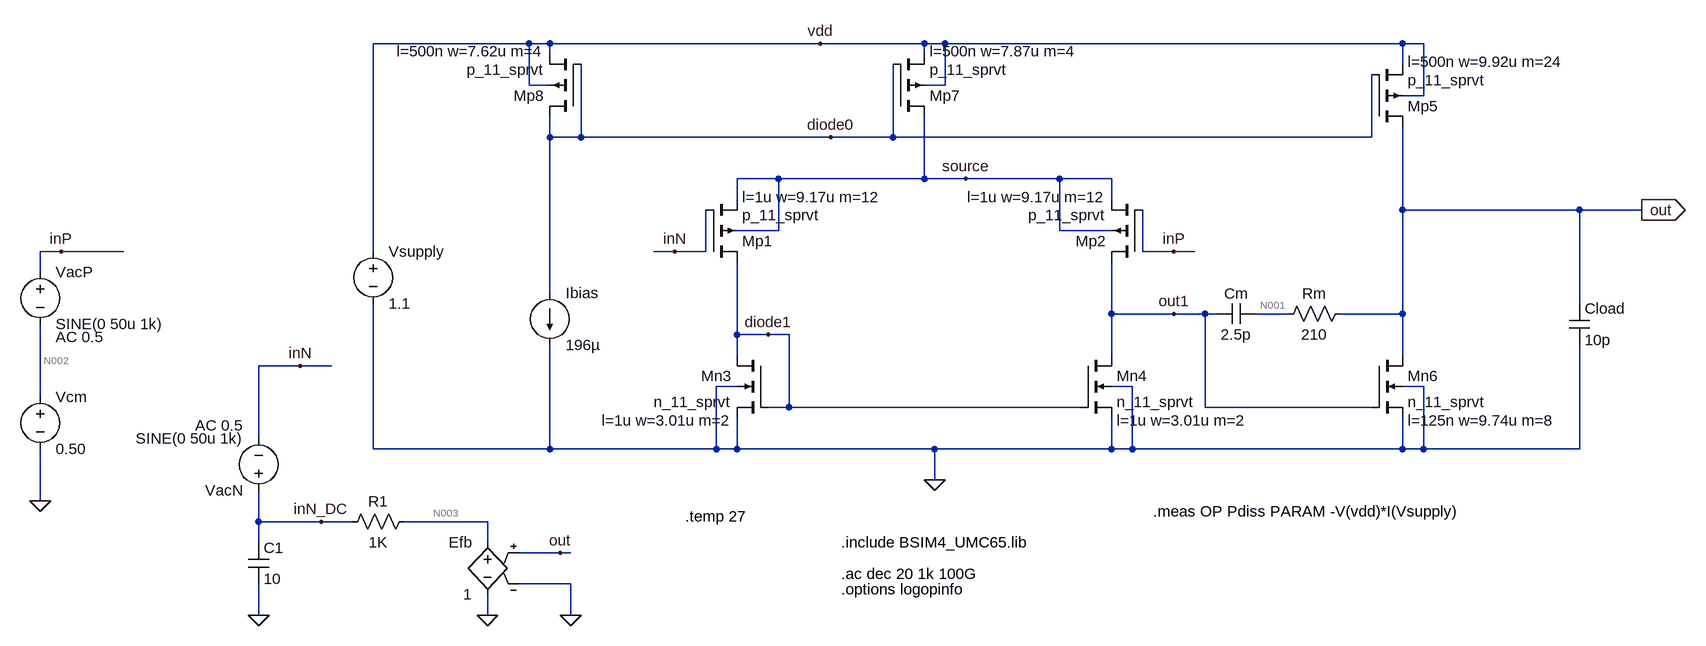
[diagram p0: schematic final_project.asc]
final_project.asc, the LTspice schematic file:
Version 4.1
SHEET 1 4000 1552
WIRE 2064 528 1824 528
WIRE 2096 528 2064 528
WIRE 2512 528 2096 528
WIRE 2672 528 2512 528
WIRE 2704 528 2672 528
WIRE 3408 528 2704 528
WIRE 3440 528 3408 528
WIRE 2096 544 2096 528
WIRE 2672 544 2672 528
WIRE 3408 560 3408 528
WIRE 2064 592 2064 528
WIRE 2096 592 2064 592
WIRE 2704 592 2704 528
WIRE 2704 592 2672 592
WIRE 3440 608 3440 528
WIRE 3440 608 3408 608
WIRE 2096 672 2096 640
WIRE 2144 672 2144 560
WIRE 2144 672 2096 672
WIRE 2528 672 2144 672
WIRE 2624 672 2624 560
WIRE 2624 672 2528 672
WIRE 3360 672 3360 576
WIRE 3360 672 2624 672
WIRE 2448 736 2384 736
WIRE 2672 736 2672 640
WIRE 2672 736 2448 736
WIRE 2736 736 2672 736
WIRE 2880 736 2736 736
WIRE 2960 736 2880 736
WIRE 2384 768 2384 736
WIRE 2960 768 2960 736
WIRE 3408 784 3408 656
WIRE 3680 784 3408 784
WIRE 3776 784 3680 784
WIRE 2448 816 2448 736
WIRE 2448 816 2384 816
WIRE 2880 816 2880 736
WIRE 2960 816 2880 816
WIRE 1344 848 1312 848
WIRE 1440 848 1344 848
WIRE 1824 848 1824 528
WIRE 2288 848 2256 848
WIRE 2336 848 2336 784
WIRE 2336 848 2288 848
WIRE 3008 848 3008 784
WIRE 3056 848 3008 848
WIRE 3088 848 3056 848
WIRE 1312 880 1312 848
WIRE 2096 912 2096 672
WIRE 3680 928 3680 784
WIRE 2960 944 2960 864
WIRE 3056 944 2960 944
WIRE 3104 944 3056 944
WIRE 3120 944 3104 944
WIRE 3232 944 3184 944
WIRE 3408 944 3408 784
WIRE 3408 944 3312 944
WIRE 2384 976 2384 864
WIRE 2432 976 2384 976
WIRE 2464 976 2432 976
WIRE 2384 1008 2384 976
WIRE 2960 1008 2960 944
WIRE 3408 1008 3408 944
WIRE 1712 1024 1648 1024
WIRE 1760 1024 1712 1024
WIRE 2384 1056 2352 1056
WIRE 2992 1056 2960 1056
WIRE 3440 1056 3408 1056
WIRE 1312 1072 1312 960
WIRE 2464 1088 2464 976
WIRE 2464 1088 2432 1088
WIRE 2912 1088 2464 1088
WIRE 3104 1088 3104 944
WIRE 3360 1088 3104 1088
WIRE 1648 1136 1648 1024
WIRE 1824 1152 1824 928
WIRE 2096 1152 2096 992
WIRE 2096 1152 1824 1152
WIRE 2352 1152 2352 1056
WIRE 2352 1152 2096 1152
WIRE 2384 1152 2384 1104
WIRE 2384 1152 2352 1152
WIRE 2688 1152 2384 1152
WIRE 2960 1152 2960 1104
WIRE 2960 1152 2688 1152
WIRE 2992 1152 2992 1056
WIRE 2992 1152 2960 1152
WIRE 3408 1152 3408 1104
WIRE 3408 1152 2992 1152
WIRE 3440 1152 3440 1056
WIRE 3440 1152 3408 1152
WIRE 3680 1152 3680 992
WIRE 3680 1152 3440 1152
WIRE 2688 1200 2688 1152
WIRE 1312 1232 1312 1152
WIRE 1648 1264 1648 1216
WIRE 1744 1264 1648 1264
WIRE 1792 1264 1744 1264
WIRE 2000 1264 1872 1264
WIRE 1648 1296 1648 1264
WIRE 2000 1296 2000 1264
WIRE 2112 1312 2048 1312
WIRE 2128 1312 2112 1312
WIRE 2128 1360 2048 1360
WIRE 1648 1408 1648 1360
WIRE 2000 1408 2000 1376
WIRE 2128 1408 2128 1360
FLAG 3776 784 out
IOPIN 3776 784 Out
FLAG 1344 848 inP
FLAG 2688 1200 0
FLAG 3056 848 inP
FLAG 2288 848 inN
FLAG 3056 944 out1
FLAG 2432 976 diode1
FLAG 2736 736 source
FLAG 2528 672 diode0
FLAG 2512 528 vdd
FLAG 2128 1408 0
FLAG 2000 1408 0
FLAG 2112 1312 out
FLAG 1648 1408 0
FLAG 1744 1264 inN_DC
FLAG 1312 1232 0
FLAG 1712 1024 inN
SYMBOL voltage 1824 832 R0
WINDOW 123 0 0 Left 0
WINDOW 39 0 0 Left 0
SYMATTR InstName Vsupply
SYMATTR Value 1.1
SYMBOL voltage 1312 1056 R0
WINDOW 123 24 124 Left 2
WINDOW 39 0 0 Left 0
SYMATTR InstName Vcm
SYMATTR Value 0.50
SYMBOL voltage 1312 864 R0
WINDOW 123 24 116 Left 2
WINDOW 39 0 0 Left 0
SYMATTR Value2 AC 0.5
SYMATTR InstName VacP
SYMATTR Value SINE(0 50u 1k)
SYMBOL pmos4 2144 640 R180
WINDOW 123 56 100 Left 2
SYMATTR Value2 l=500n w=7.62u m=4
SYMATTR InstName Mp8
SYMATTR Value p_11_sprvt
SYMBOL pmos4 2624 640 M180
WINDOW 123 56 100 Left 2
SYMATTR Value2 l=500n w=7.87u m=4
SYMATTR InstName Mp7
SYMATTR Value p_11_sprvt
SYMBOL pmos4 2336 864 M180
WINDOW 123 56 100 Left 2
SYMATTR Value2 l=1u w=9.17u m=12
SYMATTR InstName Mp1
SYMATTR Value p_11_sprvt
SYMBOL pmos4 3008 864 R180
WINDOW 123 56 100 Left 2
SYMATTR Value2 l=1u w=9.17u m=12
SYMATTR InstName Mp2
SYMATTR Value p_11_sprvt
SYMBOL nmos4 2912 1008 R0
WINDOW 123 56 100 Left 2
SYMATTR Value2 l=1u w=3.01u m=2
SYMATTR InstName Mn4
SYMATTR Value n_11_sprvt
SYMBOL nmos4 2432 1008 M0
WINDOW 123 56 100 Left 2
SYMATTR Value2 l=1u w=3.01u m=2
SYMATTR InstName Mn3
SYMATTR Value n_11_sprvt
SYMBOL nmos4 3360 1008 R0
WINDOW 123 56 100 Left 2
SYMATTR Value2 l=125n w=9.74u m=8
SYMATTR InstName Mn6
SYMATTR Value n_11_sprvt
SYMBOL pmos4 3360 656 M180
WINDOW 123 56 100 Left 2
SYMATTR Value2 l=500n w=9.92u m=24
SYMATTR InstName Mp5
SYMATTR Value p_11_sprvt
SYMBOL res 3328 928 R90
WINDOW 0 0 56 VBottom 2
WINDOW 3 32 56 VTop 2
SYMATTR InstName Rm
SYMATTR Value 210
SYMBOL cap 3184 928 R90
WINDOW 0 0 32 VBottom 2
WINDOW 3 32 32 VTop 2
SYMATTR InstName Cm
SYMATTR Value 2.5p
SYMBOL current 2096 912 R0
WINDOW 123 0 0 Left 0
WINDOW 39 0 0 Left 0
SYMATTR InstName Ibias
SYMATTR Value 196µ
SYMBOL cap 3664 928 R0
SYMATTR InstName Cload
SYMATTR Value 10p
SYMBOL e 2000 1280 M0
SYMATTR InstName Efb
SYMATTR Value 1
SYMBOL res 1888 1248 R90
WINDOW 0 0 56 VBottom 2
WINDOW 3 32 56 VTop 2
SYMATTR InstName R1
SYMATTR Value 1K
SYMBOL cap 1632 1296 R0
SYMATTR InstName C1
SYMATTR Value 10
SYMBOL voltage 1648 1232 R180
WINDOW 123 24 116 Left 2
WINDOW 39 0 0 Left 0
SYMATTR Value2 AC 0.5
SYMATTR InstName VacN
SYMATTR Value SINE(0 50u 1k)
TEXT 2544 1296 Left 2 !.include BSIM4_UMC65.lib
TEXT 2544 1344 Left 2 !.ac dec 20 1k 100G
TEXT 2544 1368 Left 2 !.options logopinfo
TEXT 2304 1256 Left 2 !.temp 27
TEXT 3024 1248 Left 2 !.meas OP Pdiss PARAM -V(vdd)*I(Vsupply)

The netlist it stands for:
* final_project.asc
Vsupply vdd 0 1.1
Vcm N002 0 0.50
VacP inP N002 SINE(0 50u 1k) AC 0.5
Mp8 diode0 diode0 vdd vdd p_11_sprvt l=500n w=7.62u m=4
Mp7 source diode0 vdd vdd p_11_sprvt l=500n w=7.87u m=4
Mp1 diode1 inN source source p_11_sprvt l=1u w=9.17u m=12
Mp2 out1 inP source source p_11_sprvt l=1u w=9.17u m=12
Mn4 out1 diode1 0 0 n_11_sprvt l=1u w=3.01u m=2
Mn3 diode1 diode1 0 0 n_11_sprvt l=1u w=3.01u m=2
Mn6 out out1 0 0 n_11_sprvt l=125n w=9.74u m=8
Mp5 out diode0 vdd vdd p_11_sprvt l=500n w=9.92u m=24
Rm out N001 210
Cm N001 out1 2.5p
Ibias diode0 0 196µ
Cload out 0 10p
Efb N003 0 out 0 1
R1 N003 inN_DC 1K
C1 inN_DC 0 10
VacN inN_DC inN SINE(0 50u 1k) AC 0.5
.model NMOS NMOS
.model PMOS PMOS
.lib standard.mos
.include BSIM4_UMC65.lib
.ac dec 20 1k 100G
.options logopinfo
.temp 27
.meas OP Pdiss PARAM -V(vdd)*I(Vsupply)
.backanno
.end

* Results of the author's LTspice run, read from the files saved beside the schematic
* Operating Point, zero values left out:
*   V(diode0) = 663.4 mV
*   V(diode1) = 426 mV
*   V(inn) = 496.4 mV
*   V(inn_dc) = 496.4 mV
*   V(inp) = 500 mV
*   V(n001) = 496.4 mV
*   V(n002) = 500 mV
*   V(n003) = 496.4 mV
*   V(out) = 496.4 mV
*   V(out1) = 350.4 mV
*   V(source) = 795.1 mV
*   V(vdd) = 1.1 V
*   I(C1) = 4.964 pA
*   I(Efb) = 48.96 nA
*   I(Ibias) = 196 µA
*   I(R1) = -48.96 nA
*   I(VacN) = -48.96 nA
*   I(VacP) = 46.92 nA
*   I(Vcm) = 46.92 nA
*   I(Vsupply) = -1.996 mA
*   Ib(Mn6) = -3.971 pA
*   Ib(Mp1) = 83.3 pA
*   Ib(Mp2) = 84.43 pA
*   Ib(Mp5) = 87.12 pA
*   Ib(Mp7) = 10.83 pA
*   Ib(Mp8) = 11.05 pA
*   Id(Mn3) = 96.49 µA
*   Id(Mn4) = 93.88 µA
*   Id(Mn6) = 1.609 mA
*   Id(Mp1) = -96.53 µA
*   Id(Mp2) = -93.89 µA
*   Id(Mp5) = -1.609 mA
*   Id(Mp7) = -190.5 µA
*   Id(Mp8) = -195.8 µA
*   Ig(Mn3) = 20.56 nA
*   Ig(Mn4) = 20.68 nA
*   Ig(Mn6) = 11.87 nA
*   Ig(Mp1) = -48.96 nA
*   Ig(Mp2) = -46.92 nA
*   Ig(Mp5) = -166.3 nA
*   Ig(Mp7) = -22.64 nA
*   Ig(Mp8) = -21.57 nA
*   Is(Mn3) = -96.51 µA
*   Is(Mn4) = -93.9 µA
*   Is(Mn6) = -1.609 mA
*   Is(Mp1) = 96.58 µA
*   Is(Mp2) = 93.94 µA
*   Is(Mp5) = 1.61 mA
*   Is(Mp7) = 190.5 µA
*   Is(Mp8) = 195.8 µA
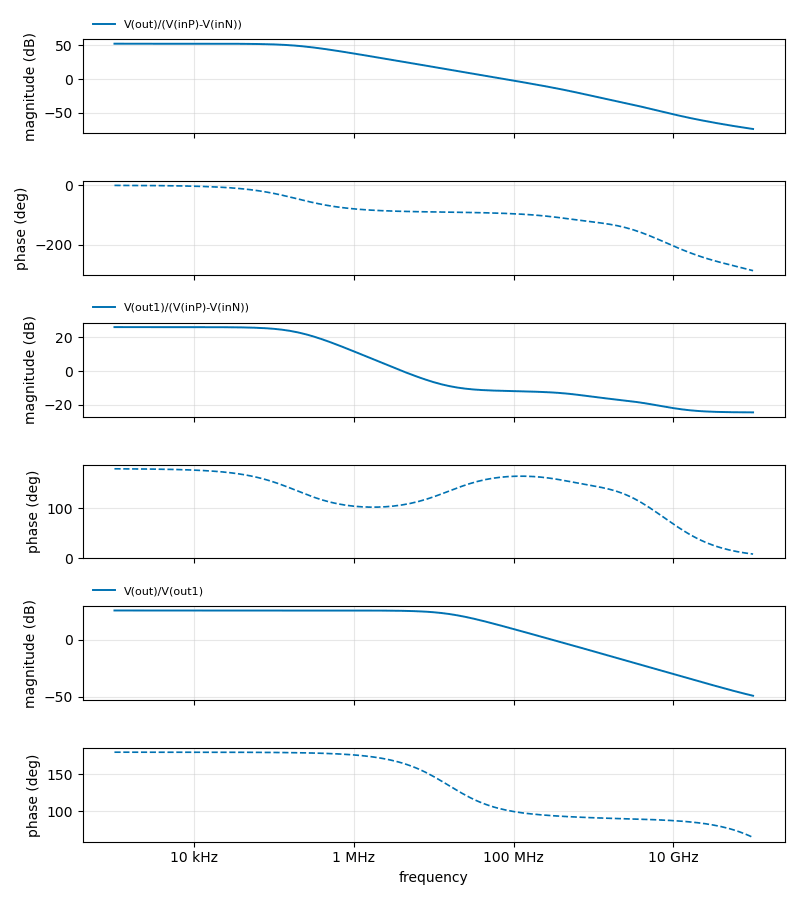
[diagram p1: AC Analysis of final_project.asc, plotted from the saved traces]
* AC Analysis, 1 run:
*   V(out)/(V(inP)-V(inN)): 52.03 dB at 1 kHz, -73.67 dB at 100 GHz, peak 52.03 dB at 1 kHz, 3 dB below the peak at 192.2 kHz
*   V(out1)/(V(inP)-V(inN)): 26.14 dB at 1 kHz, -24.59 dB at 100 GHz, peak 26.14 dB at 1 kHz, 3 dB below the peak at 192.2 kHz
*   V(out)/V(out1): 25.89 dB at 1 kHz, -49.08 dB at 100 GHz, peak 25.89 dB at 1 kHz, 3 dB below the peak at 15.29 MHz
* From the log:
*   Semiconductor Device Operating Points:
*                           --- BSIM4 MOSFETS ---
*   Name:      Mn4         Mn3         Mn6         Mp8         Mp7
*   Model:  n_11_sprvt  n_11_sprvt  n_11_sprvt  p_11_sprvt  p_11_sprvt
*   Id:      9.39e-05    9.65e-05    1.61e-03   -1.96e-04   -1.91e-04
*   Vgs:     4.26e-01    4.26e-01    3.50e-01   -4.37e-01   -4.37e-01
*   Vds:     3.50e-01    4.26e-01    4.96e-01   -4.37e-01   -3.05e-01
*   Vbs:     0.00e+00    0.00e+00    0.00e+00    0.00e+00    0.00e+00
*   Vth:     7.73e-02    7.79e-02    2.51e-01   -2.32e-01   -2.30e-01
*   Vdsat:   2.22e-01    2.21e-01    8.99e-02   -1.86e-01   -1.87e-01
*   Gm:      6.98e-04    7.18e-04    2.51e-02    1.58e-03    1.52e-03
*   Gds:     3.78e-05    3.22e-05    8.60e-04    6.86e-05    1.19e-04
*   Gmb      3.23e-05    3.38e-05    2.00e-03    1.41e-04    1.35e-04
*   Cbd:     2.41e-15    2.34e-15    2.95e-14    1.09e-14    1.23e-14
*   Cbs:     2.80e-15    2.80e-15    3.61e-14    1.55e-14    1.60e-14
*   Name:      Mp1         Mp2         Mp5
*   Model:  p_11_sprvt  p_11_sprvt  p_11_sprvt
*   Id:     -9.65e-05   -9.39e-05   -1.61e-03
*   Vgs:    -2.99e-01   -2.95e-01   -4.37e-01
*   Vds:    -3.69e-01   -4.45e-01   -6.04e-01
*   Vbs:     0.00e+00    0.00e+00    0.00e+00
*   Vth:    -2.06e-01   -2.07e-01   -2.33e-01
*   Vdsat:  -1.03e-01   -1.00e-01   -1.85e-01
*   Gm:      1.38e-03    1.36e-03    1.30e-02
*   Gds:     3.30e-05    2.72e-05    4.12e-04
*   Gmb      1.28e-04    1.28e-04    1.16e-03
*   Cbd:     4.10e-14    3.92e-14    7.78e-14
*   Cbs:     5.61e-14    5.61e-14    1.21e-13